# EAGLE design Adafruit HUZZAH ESP8266 Basic Breakout (EAGLE 6.6.0)
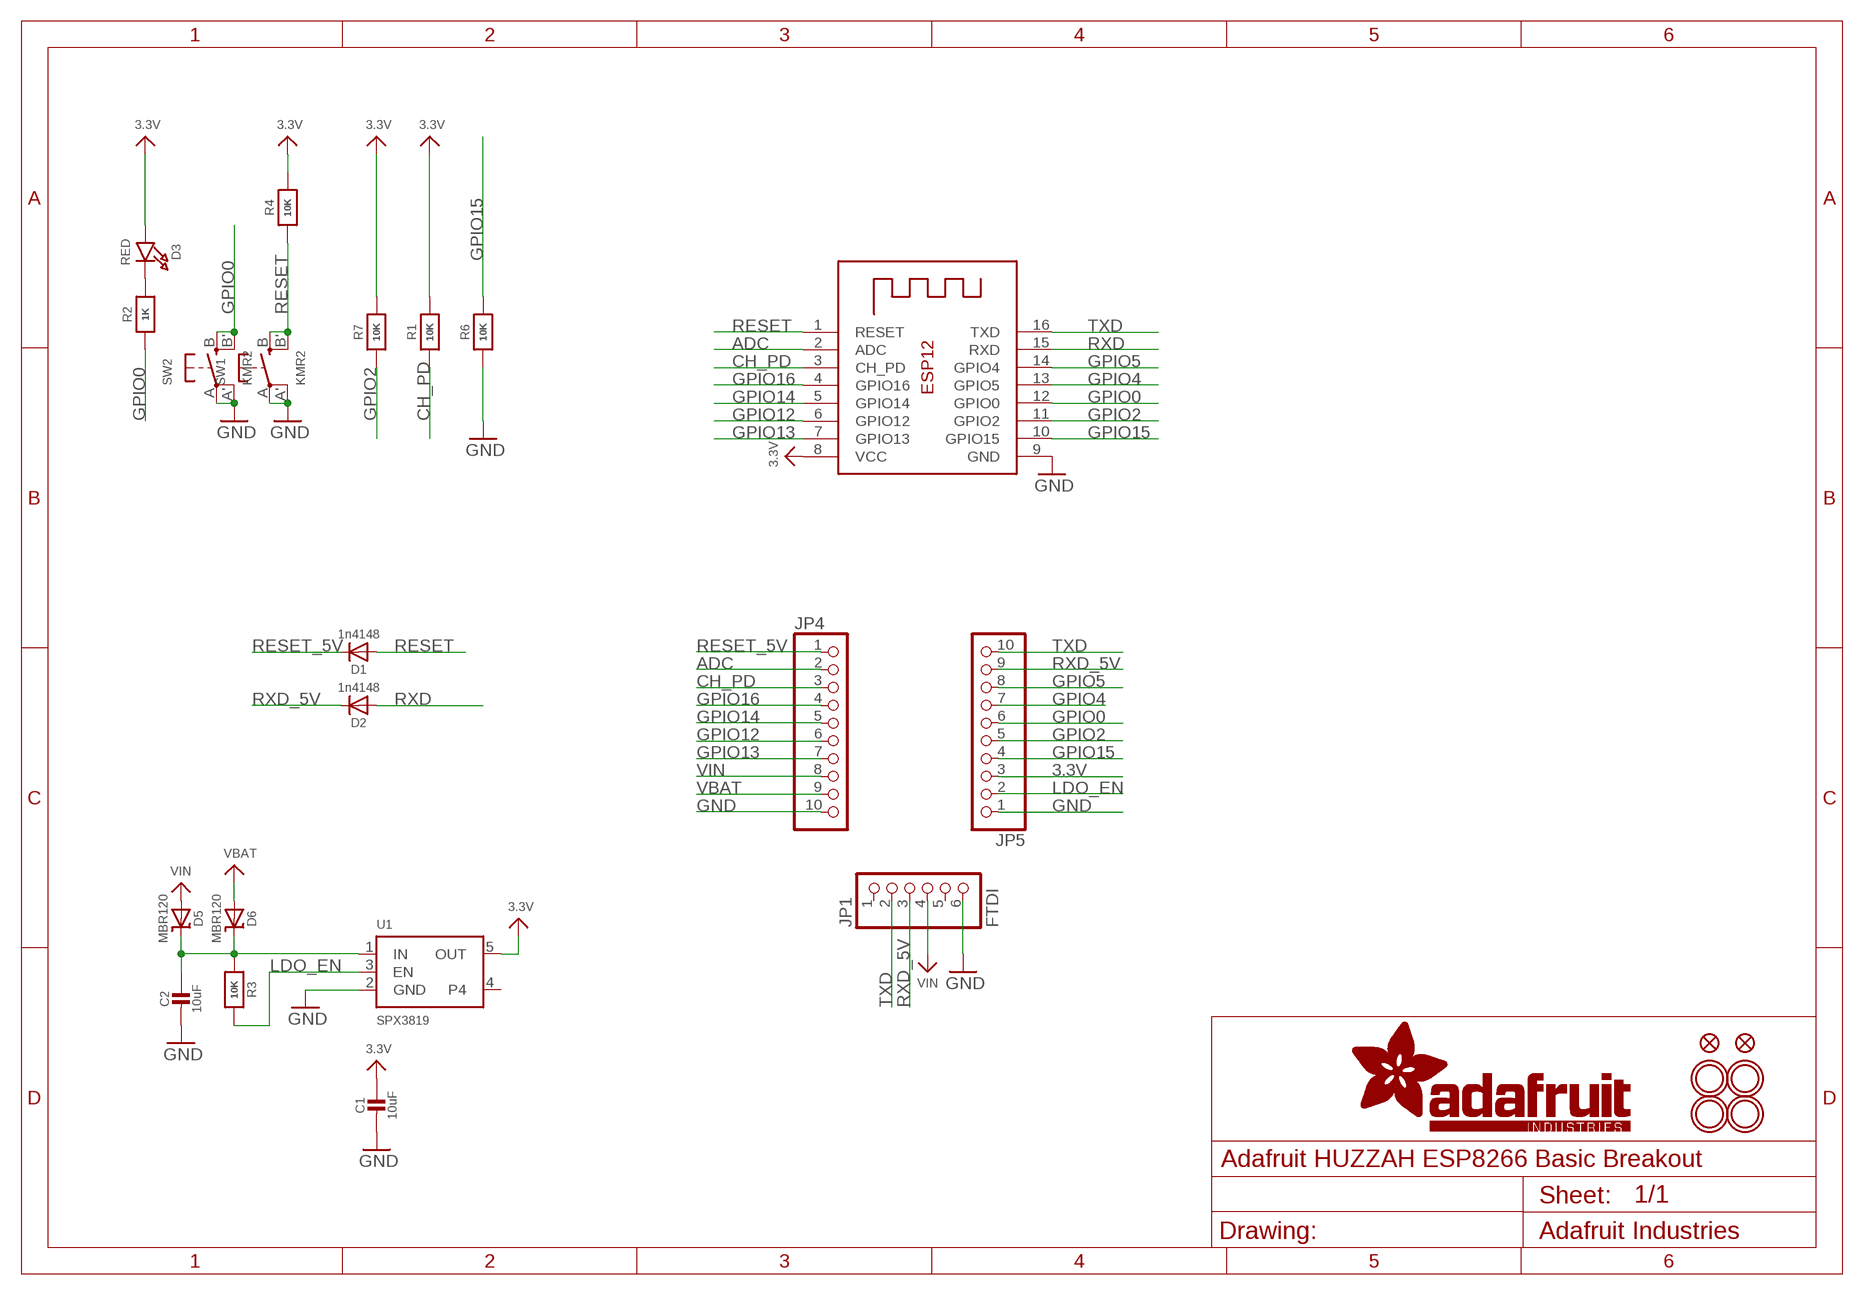
[diagram p0: schematic, sheet 1]

## Parts
C1  10uF  CAP_CERAMIC0805-NOOUTLINE  [0805-NO]
C2  10uF  CAP_CERAMIC0805-NOOUTLINE  [0805-NO]
D1  1n4148  DIODESOD-323  [SOD-323]
D2  1n4148  DIODESOD-323  [SOD-323]
D3  RED  LED0805_NOOUTLINE  [CHIPLED_0805_NOOUTLINE]
D5  MBR120  DIODE-SCHOTTKYSOD-123  [SOD-123]
D6  MBR120  DIODE-SCHOTTKYSOD-123  [SOD-123]
FID1  FIDUCIAL""  [FIDUCIAL_1MM]
FID3  FIDUCIAL""  [FIDUCIAL_1MM]
JP1  FTDI  HEADER-1X670MIL  [1X06_ROUND_70]
JP4  HEADER-1X1070MIL  [1X10_ROUND70]
JP5  HEADER-1X1070MIL  [1X10_ROUND70]
R1  10K  RESISTOR0805_NOOUTLINE  [0805-NO]
R2  1K  RESISTOR0805_NOOUTLINE  [0805-NO]
R3  10K  RESISTOR0805_NOOUTLINE  [0805-NO]
R4  10K  RESISTOR0805_NOOUTLINE  [0805-NO]
R6  10K  RESISTOR0805_NOOUTLINE  [0805-NO]
R7  10K  RESISTOR0805_NOOUTLINE  [0805-NO]
SW1  KMR2  SWITCH_TACT_SMT4.6X2.8  [BTN_KMR2_4.6X2.8]
SW2  KMR2  SWITCH_TACT_SMT4.6X2.8  [BTN_KMR2_4.6X2.8]
U1  SPX3819  VREG_SOT23-5  [SOT23-5]
U$15  MOUNTINGHOLE2.5  [MOUNTINGHOLE_2.5_PLATED]
U$16  MOUNTINGHOLE2.5  [MOUNTINGHOLE_2.5_PLATED]
U$17  MOUNTINGHOLE2.5  [MOUNTINGHOLE_2.5_PLATED]
U$18  MOUNTINGHOLE2.5  [MOUNTINGHOLE_2.5_PLATED]
X1  ESP-12  [ESP-12]

## Nets
3.3V: C1.1 D3.A JP5.3 R1.2 R4.2 R7.2 U1.5(OUT) X1.8(VCC)
ADC: JP4.2 X1.2(ADC)
CH_PD: JP4.3 R1.1 X1.3(CH_PD)
GND: C1.2 C2.2 JP1.6 JP4.10 JP5.1 R6.1 SW1.A'(P1) SW1.A(P) SW2.A'(P1) SW2.A(P) U1.2(GND) X1.9(GND)
GPIO0: JP5.6 R2.1 SW2.B'(S1) SW2.B(S) X1.12(GPIO0)
GPIO2: JP5.5 R7.1 X1.11(GPIO2)
GPIO4: JP5.7 X1.13(GPIO5)
GPIO5: JP5.8 X1.14(GPIO4)
GPIO12: JP4.6 X1.6(GPIO12)
GPIO13: JP4.7 X1.7(GPIO13)
GPIO14: JP4.5 X1.5(GPIO14)
GPIO15: JP5.4 R6.2 X1.10(GPIO15)
GPIO16: JP4.4 X1.4(GPIO16)
LDO_EN: JP5.2 R3.2 U1.3(EN)
N$1: D3.C R2.2
N$2: C2.1 D5.C D6.C R3.1 U1.1(IN)
RESET: D1.A R4.1 SW1.B'(S1) SW1.B(S) X1.1(RESET)
RESET_5V: D1.C JP4.1
RXD: D2.A X1.15(RXD)
RXD_5V: D2.C JP1.3 JP5.9
TXD: JP1.2 JP5.10 X1.16(TXD)
VBAT: D6.A JP4.9
VIN: D5.A JP1.4 JP4.8
Unconnected: JP1.1 JP1.5 U1.4

## Library data of the parts
C1 C2 = microbuilder:CAP_CERAMIC: Ceramic Capacitors For new designs, use the packages preceded by an '_' character since they are more reliable: The following footprints should be used on most boards: _0402 - Standard footprint for regular board layouts _0603 - Standard footprint for regular board layouts _0805 - Standard footprint for regular board layouts _1206 - Standard footprint for regular board layouts For extremely tight-pitch boards where space is at a premium, the following 'micro-pitch' footprints can be used (smaller pads, no silkscreen outline, etc.): _0402MP - Micro-pitch footprint for very dense/compact boards _0603MP - Micro-pitch footprint for very dense/compact boards _0805MP - Micro-pitch footprint for very dense/compact boards _1206MP - Micro-pitch footprint for very dense/compact boards
D1 D2 = microbuilder:DIODE: Diode SMA Model Volts Amps Type Vf Ir Digikey # Notes SSA34-E3 40V 3A Schottky 480mV @ 3A 200uA @ 40V SSA34-E3/61TGITR-ND CDBA120-G 20V 1A Schottky 500mV @ 1A 500uA @ 20V 641-1014-6-ND REEL MBRA210 10V 2A Schottky 350mV @ 2A 700uA @ 10V MBRA210LT3 SOD-123 Model Volts Amps Type Vf Ir Order # Notes BAT54T1G 30V 200mA Schottky 800mV @ 200mA 2uA @ 25V BAT54T1GOSTR-ND B0530W 30V 500mA Schottky 430mV @ 500mA 130uA @ 30V B0530W-FDICT-ND REEL MBR120 20V 1A Schottky 340mV @ 1A MBR120VLSFT1GOSCT-ND SOD-323 Model Volts Amps Type Vf Ir Order # Notes PMEG2005EJ 20V 500mA Schottky 355mV @ 500mA 568-4110-1-ND ZLLS410 10V 570mA Schottky 380mV @ 570mA ZLLS410CT-ND 1N4148WS 75V 150mA Silicon/Simple 1V 1N4148WSFSCT-ND REEL SOD-523 Model Volts Amps Type Vf Ir Order # Notes BAT54XV2 30V 200mA Schottky 0.8V @ 100mA BAT54XV2CT-ND TB751S 30V 30mA Schottky RB751S-40TE61CT-ND SOT23-R/W (R = Solder Paste/Reflow Ovens, W = Hand-Soldering) Model Volts Amps Type Vf Ir Order # Notes BAT54FILM 40V 300mA Schottky 497-7162-1-ND POWERDI-5 Model Volts Amps Type Vf Ir Order # Notes PDS560 60V 5A Schottky 670mV @ 5A 150uA @ 60V PDS560DICT-ND
D3 = microbuilder:LED: LED 0603 - 0603 Surface Mount Package 2mA: Green LED - Low Power (3.9mcd, 2ma, 1.7Vf) - Digikey: 475-2709-2-ND Orange LED - Low Power (9.8mcd, 2ma, 1.8Vf) - Digikey: 475-1194-2-ND Red LED - Low Power (5mcd, 2ma, 1.8Vf) - Digikey: 475-1195-2-ND Yellow LED - Low Power (7mcd, 2ma, 1.8Vf) - Digikey: 475-1196-2-ND 5mA: Blue LED - Low Power (17mcd, 5ma, 2.9Vf) - Digikey: LNJ937W8CRACT-ND 0805 - 0805 Surface Mount Package 2mA: Red LED (8.8mcd, 2mA, 1.8Vf, Clear) - Low Power [Digikey: 475-2510-1-ND] Green LED (5mcd, 2mA, 1.8Vf, Clear) - Low Power [Digikey: 475-2730-1-ND] Yellow LED (11.3mcd, 2mA, 1.8Vf, Clear) - Low Power [Digikey: 475-2555-1-ND] 20mA: Red LED (104mcd, 20mA, Diffused) - LS R976 [Digikey: 475-1278-6-ND] Red LED (12mcd, 20mA, 2.0Vf, Clear) - APT2012EC [Digikey: 754-1128-1-ND] Green LED (15mcd, 20mA, 2.2Vf, Clear) - APT2012GC [Digikey: 754-1131-1-ND] Orange LED (160mcd, 20mA, 2.1Vf, Clear) - APT2012SECK [Digikey: 754-1130-1-ND] 1206 - 1206 Surface Mount Package Green LED (26mcd, 20mA, Diffused) - LG N971 [Digikey: 475-1407-6-ND] Red LED (15mcd, 20mA, Diffused) - LH N974 [Digikey: 475-1416-6-ND] Cree - Cree High-Power Surface Mount LEDs XPEBWT-L1-0000-00D50 - White 111lm 350mA 2.9Vf 6200K 110° XTEAWT-00-0000-00000LEE3 - White 114lm 350mA 2.85Vf 5000K 115° Everlight - Everlight 45-21 Series Surface Mount LEDs 45-21/QK2C-B2832AC2CB2/2T - Warm White 2000mcd 20mA 3.25Vf 3050K 120° 45-21/LK2C-B38452C4CB2/2T - Nuetral White 2000mcd 20mA 3.25Vf 4150K 120° 45-21/LK2C-B50634C6CB2/2T - Cold White 2200mcd 20mA 3.25Vf 5650K 120° PLCC2 Reverse Mount LS T77K-J1L2-1-0-2-R18-Z - Red 11.25mcd 2mA 1.8Vf 630nm 120° LO T77K-L1M2-24-Z - Orange 19.6mcd 2mA 1.8Vf 606nm 120° LY T77K-K2M1-26-Z - Yellow 15.7mcd 2mA 1.8Vf 587nm 120°
D5 D6 = microbuilder:DIODE-SCHOTTKY
FID1 FID3 = microbuilder:FIDUCIAL: Fiducial Alignment Points Various fiducial points for machine vision alignment.; BOM: EXCLUDE
JP1 = microbuilder:HEADER-1X6: PIN HEADER
JP4 JP5 = microbuilder:HEADER-1X10: PIN HEADER
R1-R4 R6 R7 = microbuilder:RESISTOR: Resistors For new designs, use the packages preceded by an '_' character since they are more reliable: The following footprints should be used on most boards: _0402 - Standard footprint for regular board layouts _0603 - Standard footprint for regular board layouts _0805 - Standard footprint for regular board layouts _1206 - Standard footprint for regular board layouts For extremely tight-pitch boards where space is at a premium, the following 'micro-pitch' footprints can be used (smaller pads, no silkscreen outline, etc.): _0402MP - Micro-pitch footprint for very dense/compact boards _0603MP - Micro-pitch footprint for very dense/compact boards _0805MP - Micro-pitch footprint for very dense/compact boards _1206MP - Micro-pitch footprint for very dense/compact boards
SW1 SW2 = microbuilder:SWITCH_TACT_SMT: SMT Tact Switches 6x6mm - Digikey: P12940SCT-ND KMR2 (4.6x2.8mm) - Digikey: 401-1426-1-ND EVQ-PQHB55 - Light Touch, 160GF (4.5x4.5mm) - Digikey: P8090SCT-ND KMT0 - KMT021 NGJ LHS (etc.) IP68/Waterproof - Digikey: CKN10289CT-ND
U1 = microbuilder:VREG_SOT23-5: SOT23-5 Fixed Voltage Regulators Part Current Out V Out V In V Dropout θJA (°C/W) TJ (°C) Digikey Part No. ADP121 150mA 3.3V 3.4-5.5V 0.09V @ 150mA -- -- ADP121-AUJZ33R7CT-ND ADP121 150mA 3.0V 3.1-5.5V 0.09V @ 150mA -- -- ADP121-AUJZ30R7CT-ND ADP122 300mA 3.3V 3.4-5.5V 0.085V @ 300mA -- -- ADP122AUJZ-3.3-R7CT-ND ADP1712 300mA 3.3V 3.5-5.5V 0.17V @ 300mA -- -- ADP1712AUJZ-3.3-R7TR-ND AP7311 (Low Cost) 150mA 3.3V 3.5-6V 0.15V @ 150mA -- -- AP7311-33WG-7DICT-ND LD39015M18R 150mA 1.8V 1.9V-5.5V 0.08V @ 100mA -- -- 497-6977-1-ND LP2985A-33DBVR 150mA 3.3V 3.3-16V 0.28V @ 150mA 206 150 296-18479-1-ND MCP1824T-3302E/OT 300mA 3.3V 3.5V-6V 0.2V @ 300mA -- -- MCP1824T-3302E/OTCT-ND MIC5205-2.5YM5 TR 150mA 2.5V 2.7-16V 0.165V @ 150mA -- -- 576-1257-2-ND MIC5205-3.0YM5 TR 150mA 3.0V 3.2V-16V 0.165V @ 150mA -- -- 576-1258-2-ND MIC5205-3.3YM5 TR 150mA 3.3V 3.5V-16V 0.165V @ 150mA -- -- 576-1259-2-ND TPS780330220 150mA 3.3V+2.2V 3.6-5.5V 250mV Max -- -- 296-23332-1-ND TDA3663/N1,135 100mA 3.3V 3.5-45V 0.18V @ 50mA -- -- 568-5343-1-ND Max operating temp can be calculated using θJA, TJ (max junction temperature), and power in watts. Set the "Maximum Ambient Temperature" until it reaches TJ ("Max Junction Temperature"), which is the absolute limit for safe use of the regulator: Heat Sink Temperature Calculator <http://www.daycounter.com/Calculators/Heat-Sink-Temperature-Calculator.phtml> For example, With 12V source into a 3.3V LP2985 and a 30mA load, we are dissipating (12V-3.3V) * 0.03A = 0.261W. With a θJA of 206 °C/W, a TJ of 150°C, and 261mW we can safely use the chip without a heat sink up to 75°C (=147.1°C Junction Temperature).
U$15-U$18 = microbuilder:MOUNTINGHOLE: Mounting Hole For #2 screws (0.086"/2.18mm width, 0.094"/2.4mm hole) use 2.5mm; BOM: EXCLUDE
X1 = microbuilder:ESP-12

## Board
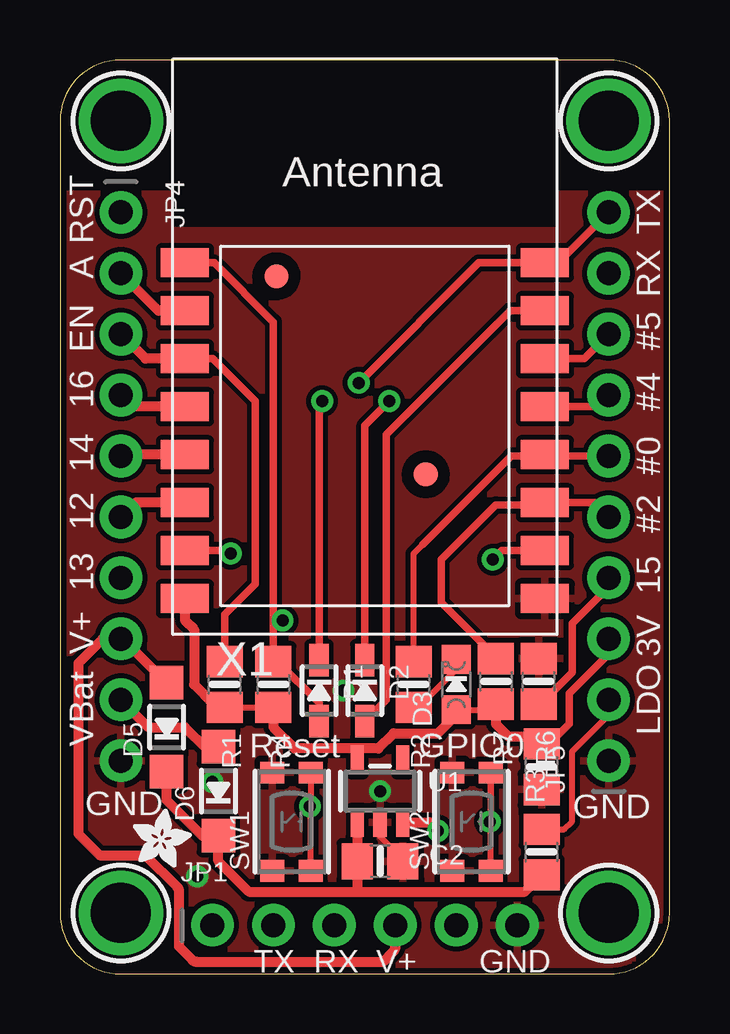
[diagram p1: board, top side]
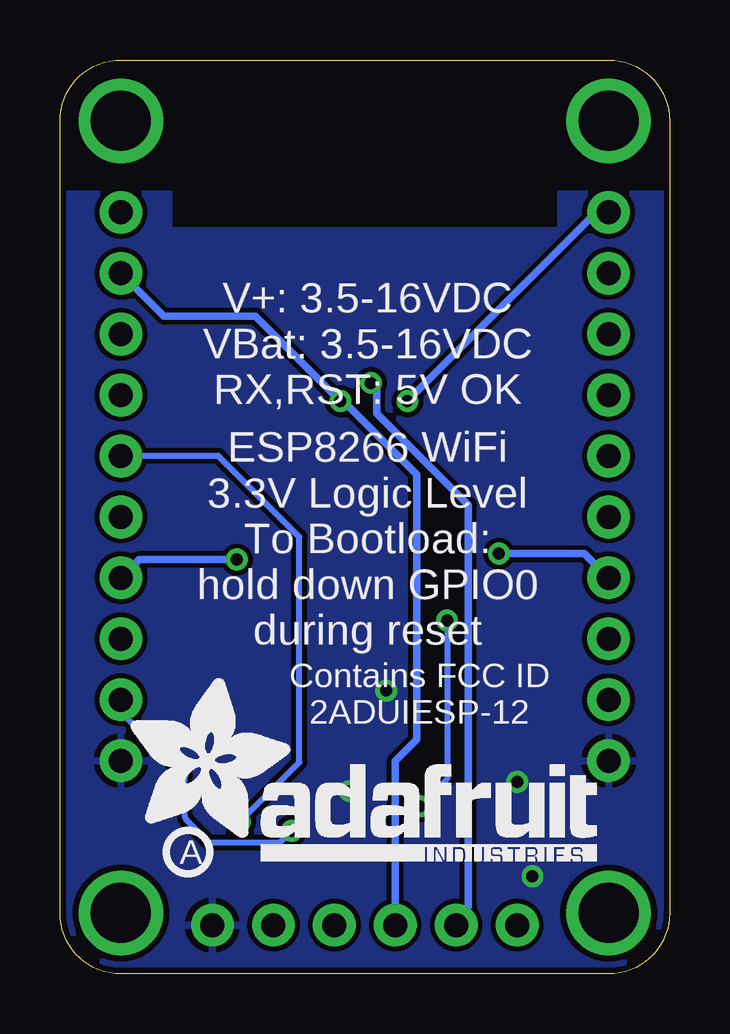
[diagram p2: board, bottom side, seen from below]

Size 25.4 x 38.1 mm. Coordinates in mm from the lower left corner, seen from the top.
Outline: 0,35.56 0,2.54 arc90 2.54,0 22.86,0 arc90 25.4,2.54 25.4,35.56 arc90 22.86,38.1 2.54,38.1 arc90 0,35.56
Copper layers (1*16): Top 0.035mm / dielectric 1.5mm / Bottom 0.035mm
Design rules "adafruit *": minimum track width 10mil, minimum drill 15.5mil, track to track 8mil, track to pad 8mil, pad to pad 8mil, via to via 8mil, smd to smd 8mil, copper to edge 10mil, drill to drill 8mil, minimum pad ring 10mil, minimum via ring 8mil, stop-mask expansion 2mil, vias tented up to drill 20mil, thermal gap 10mil

### Footprints (pad centres in the part's own frame; a part is rotated, then mirrored left to right if it is on the bottom)
0805-NO = smd 1.3 x 1.5: 1 -0.95,0; 2 0.95,0
SOD-323 = smd 1.35 x 0.8: A 1.27,0; C -1.27,0
CHIPLED_0805_NOOUTLINE = smd 1.2 x 1.2: A 0,-1.05; C 0,1.05
SOD-123 = smd 1.4 x 1.4: A 1.85,0; C -1.85,0
FIDUCIAL_1MM = smd 1 x 1: 1 0,0
1X06_ROUND_70 = drill 1 pad 1.778: 1 -6.35,0; 2 -3.81,0; 3 -1.27,0; 4 1.27,0; 5 3.81,0; 6 6.35,0
1X10_ROUND70 = drill 1 pad 1.778: 1 -11.43,0; 2 -8.89,0; 3 -6.35,0; 4 -3.81,0; 5 -1.27,0; 6 1.27,0; 7 3.81,0; 8 6.35,0; 9 8.89,0; 10 11.43,0
BTN_KMR2_4.6X2.8 = smd 0.9 x 1: A 2.05,0.8; A' -2.05,0.8; B 2.05,-0.8; B' -2.05,-0.8
SOT23-5 = smd 0.55 x 1.2: 1 -0.95,-1.3; 2 0,-1.3; 3 0.95,-1.3; 4 0.95,1.3; 5 -0.95,1.3
MOUNTINGHOLE_2.5_PLATED = drill 2.5 pad 3.2: P$1 0,0
ESP-12 = smd 2 x 1.2: 1 -7.5,4.5; 2 -7.5,2.5; 3 -7.5,0.5; 4 -7.5,-1.5; 5 -7.5,-3.5; 6 -7.5,-5.5; 7 -7.5,-7.5; 8 -7.5,-9.5; 9 7.5,-9.5; 10 7.5,-7.5; 11 7.5,-5.5; 12 7.5,-3.5; 13 7.5,-1.5; 14 7.5,0.5; 15 7.5,2.5; 16 7.5,4.5

### Placement (x,y rotation side)
C1  20.07,8.64 270 top
C2  13.34,4.7 0 top
D1  10.79,11.81 270 top
D2  12.7,11.81 270 top
D3  16.51,12.06 0 top
D5  4.45,10.29 90 top
D6  6.6,7.62 90 top
FID1  9.02,29.08 0 top
FID3  15.24,20.83 0 top
JP1  12.7,2.03 0 top
JP4  2.54,20.32 270 top
JP5  22.86,20.32 90 top
R1  6.86,12.06 270 top
R2  14.73,12.06 270 top
R3  20.07,5.08 90 top
R4  8.89,12.06 270 top
R6  19.94,12.19 270 top
R7  18.16,12.19 270 top
SW1  9.65,6.35 90 top
SW2  17.14,6.35 90 top
U1  13.34,7.62 0 top
U$2  [HUZZAHLOGO]  21.59,30.61 0 bottom
U$3  [ADAFRUIT_2.5MM]  3.05,4.45 0 top
U$12  [ADAFRUIT_TEXT_20MM]  22.61,4.7 0 bottom
U$13  [PCBFEAT-REV-040]  20.07,5.08 0 bottom
U$15  22.86,35.56 0 top
U$16  2.54,35.56 0 top
U$17  22.86,2.54 0 top
U$18  2.54,2.54 0 top
X1  12.7,25.15 0 top

### Tracks (layer width: path | path; a pad name or v marks a point on that pad's centre or on a via)
3.3V
  Top 0.254: D3.A 17.93,11.02 R7.2 | R4.2 R1.2 6.8,11.18
  Top 0.305: JP5.3 22.61,13.97 22.66,13.92 arc-45 22.73,13.74 22.73,13.21 21.21,11.68 21.21,10.41 20.7,9.91 20.07,9.91
  Top 0.406: X1.8 5.2,14.74 5.59,14.35 5.59,12.06 6.35,11.3 6.67,11.3 R1.2 | C1.1 20.07,9.91 18.67,9.91 18.16,10.41 R7.2 | R4.2 8.89,10.29 9.78,9.4 12.38,9.4 | 12.38,9.4 13.27,9.4 13.9,10.03 15.75,10.03 16.51,10.79 D3.A | U1.5 12.38,9.4
ADC
  Top 0.406: X1.2 4.1,27.65 JP4.2
CH_PD
  Top 0.305: X1.3 6.36,25.65 8.13,23.88 8.13,16.26 6.86,14.99 R1.1
  Top 0.406: X1.3 3.56,25.65 JP4.3
GND  (via drill 0.5)
  Top 0.254: C2.2 14.29,4.76 13.34,5.71 U1.2
  other vias: 13.34,7.62 11.81,11.81 5.71,4.06 6.35,8
  pour Top: 0,0 0,32.51 25.4,32.51 25.4,0
  pour Bottom: 0,0 0,32.51 25.4,32.51 25.4,0
GPIO0  (via drill 0.5)
  Top 0.254: SW2.B' SW2.B | SW2.B 17.95,8.47 | SW2.B 17.95,6.39 v17.91,6.35 | R2.1 14.73,17.53 15.11,17.91
  Top 0.305: 15.11,17.91 18.8,21.59 20.14,21.59 | 20.14,21.59 X1.12 | 20.14,21.59 JP5.6
  Bottom 0.254: v17.91,6.35 15.43,8.83 15.43,18.22 18.8,21.59 JP5.6
GPIO2
  Top 0.305: R7.1 18.16,13.21 15.88,15.49 15.88,17.27 18.16,19.56 20.11,19.56 X1.11 22.26,19.65 JP5.5
GPIO4
  Top 0.305: X1.13 22.38,23.65 JP5.7
GPIO5
  Top 0.305: X1.14 21.84,25.65 JP5.8
GPIO12
  Top 0.305: 4.91,19.65 X1.6
  Top 0.406: 4.91,19.65 3.14,19.65 JP4.6
GPIO13  (via drill 0.5)
  Top 0.305: v7.11,17.53 6.99,17.65 X1.7
  Bottom 0.305: v7.11,17.53 3.56,17.53 JP4.7
GPIO14
  Top 0.305: 4.37,21.65 X1.5
  Top 0.406: 4.37,21.65 2.6,21.65 JP4.5
GPIO15  (via drill 0.5)
  Top 0.254: 20.13,11.37 20.07,11.37 R6.2
  Top 0.305: X1.10 18.41,17.65 v18.03,17.27 | 20.13,11.37 21.34,12.57 21.34,14.61 22.86,16.13 JP5.4
  Bottom 0.305: v18.03,17.27 22.1,17.27 JP5.4
GPIO16
  Top 0.406: X1.4 3.02,23.65 JP4.4
LDO_EN  (via drill 0.5)
  Top 0.254: R3.2 21.02,6.03 21.34,6.35 21.34,9.27 22.86,10.79 JP5.2
  Top 0.406: U1.3 15.4,6.32 v15.75,5.97
  Bottom 0.254: v15.75,5.97 16.18,5.54 arc45 16.36,5.46 19.18,5.46 20.12,6.4 arc45 20.19,6.58 20.19,8.26 22.86,10.92 JP5.2 22.86,11.41 arc-45 22.79,11.23
N$1
  Top 0.254: D3.C 16.51,12.7 14.8,10.99 14.8,11.05 R2.2
N$2
  Top 0.406: 12.38,3.43 7.87,3.43 6.6,4.7 D6.C 5.91,5.77 4.45,7.24 D5.C | 12.38,3.43 19.36,3.43 R3.1 | 12.38,3.43 C2.1 U1.1
RESET  (via drill 0.5)
  Top 0.254: SW1.B' 10.45,6.95 v10.41,6.99 10.45,7.02 SW1.B
  Top 0.305: D1.A 10.79,11.3 9.08,13.02 R4.1 | X1.1 6.42,29.65 8.89,27.18 R4.1 | v9.27,14.73 8.89,14.73 R4.1
  Bottom 0.254: v9.27,14.73 9.27,8.13 v10.41,6.99
RESET_5V  (via drill 0.5)
  Top 0.305: v10.92,23.88 10.79,23.75 D1.C
  Bottom 0.305: v10.92,23.88 3.05,31.75 JP4.1
RXD
  Top 0.305: D2.A 13.59,11.43 13.59,22.48 18.76,27.65 X1.15
RXD_5V  (via drill 0.5)
  Top 0.305: D2.C 12.7,22.86 v13.72,23.88
  Bottom 0.305: JP1.3 11.43,8.89 10.54,9.78 10.54,20.83 13.59,23.88 v13.72,23.88 17.27,27.43 21.08,27.43 JP5.9
TXD  (via drill 0.5)
  Top 0.305: X1.16 20.53,29.97 | v12.45,24.64 17.45,29.65 X1.16 | JP5.10 20.76,29.65 X1.16
  Bottom 0.305: JP1.2 8.89,2.29 8.38,2.79 8.38,19.56 12.19,23.37 12.19,24.38 v12.45,24.64
VBAT
  Top 0.406: JP4.9 3.68,10.29 5.21,10.29 6.1,9.4 6.53,9.4 D6.A
VIN
  Top 0.406: JP1.4 13.97,1.12 arc-45 13.9,0.94 13.46,0.51 5.69,0.51 arc-45 5.51,0.58 4.95,1.14 4.95,3.45 arc45 4.88,3.63 3.56,4.95 1.65,4.95 0.76,5.84 0.76,12.95 1.78,13.97 JP4.8 2.61,13.97 D5.A

### Text on the board
tPlace: RST | TX | A | RX | EN | #5 | 16 | #4 | 14 | #0 | 12 | #2 | 13 | 15 | V+ | 3V | VBat | LDO | Reset | GPIO0 | GND | GND | TX | RX | V+ | GND
bPlace: V+: 3.5-16VDC / VBat: 3.5-16VDC / RX,RST: 5V OK | ESP8266 WiFi / 3.3V Logic Level / To Bootload: / hold down GPIO0 / during reset | Contains FCC ID / 2ADUIESP-12